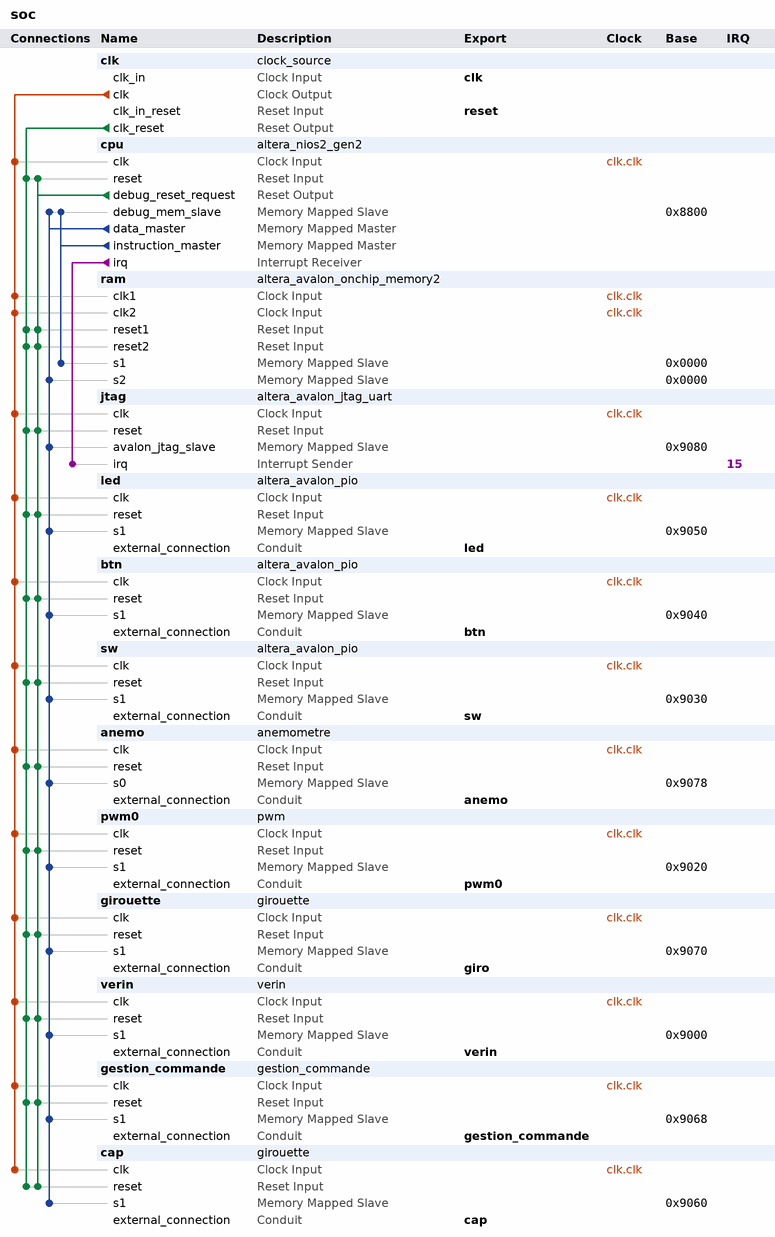
[diagram p0: system contents]
# Platform Designer (Qsys) system soc, Cyclone IV E EP4CE22F17C6
# Parameters at their usual value, and those the tool derives, are not listed.
package require -exact qsys 18.1
create_system soc
set_project_property DEVICE_FAMILY {Cyclone IV E}
set_project_property DEVICE EP4CE22F17C6

add_instance clk clock_source 18.1
set_instance_parameter_value clk clockFrequency 50000000

add_instance cpu altera_nios2_gen2 18.1
set_instance_parameter_value cpu dcache_size 2048
set_instance_parameter_value cpu exceptionSlave ram.s1
set_instance_parameter_value cpu icache_size 4096
set_instance_parameter_value cpu impl Tiny
set_instance_parameter_value cpu resetSlave ram.s1

add_instance ram altera_avalon_onchip_memory2 18.1
set_instance_parameter_value ram dataWidth 32
set_instance_parameter_value ram dualPort true
set_instance_parameter_value ram initMemContent true
set_instance_parameter_value ram initializationFileName onchip_mem.hex
set_instance_parameter_value ram memorySize 32768

add_instance jtag altera_avalon_jtag_uart 18.1
set_instance_parameter_value jtag simInteractiveOptions NO_INTERACTIVE_WINDOWS

add_instance led altera_avalon_pio 18.1
set_instance_parameter_value led direction Output
set_instance_parameter_value led width 8

add_instance btn altera_avalon_pio 18.1
set_instance_parameter_value btn direction Input
set_instance_parameter_value btn width 1

add_instance sw altera_avalon_pio 18.1
set_instance_parameter_value sw direction Input
set_instance_parameter_value sw width 4

add_instance anemo anemometre 1.0
set_instance_parameter_value anemo G_FREQ_IN 50000000

add_instance pwm0 pwm 1.0
set_instance_parameter_value pwm0 G_PWM_RESOLUTION 32

add_instance girouette girouette 1.0
set_instance_parameter_value girouette G_FREQ_IN 50000000

add_instance verin verin 1.0
set_instance_parameter_value verin G_FREQ_ADC 1000000
set_instance_parameter_value verin G_FREQ_IN 50000000

add_instance gestion_commande gestion_commande 1.0
set_instance_parameter_value gestion_commande G_FREQ_IN 50000000

add_instance cap girouette 1.0
set_instance_parameter_value cap G_FREQ_IN 50000000

# connections
add_connection clk.clk anemo.clk clock
add_connection clk.clk btn.clk clock
add_connection clk.clk cap.clk clock
add_connection clk.clk cpu.clk clock
add_connection clk.clk gestion_commande.clk clock
add_connection clk.clk girouette.clk clock
add_connection clk.clk jtag.clk clock
add_connection clk.clk led.clk clock
add_connection clk.clk pwm0.clk clock
add_connection clk.clk ram.clk1 clock
add_connection clk.clk ram.clk2 clock
add_connection clk.clk sw.clk clock
add_connection clk.clk verin.clk clock
add_connection clk.clk_reset anemo.reset reset
add_connection clk.clk_reset btn.reset reset
add_connection clk.clk_reset cap.reset reset
add_connection clk.clk_reset cpu.reset reset
add_connection clk.clk_reset gestion_commande.reset reset
add_connection clk.clk_reset girouette.reset reset
add_connection clk.clk_reset jtag.reset reset
add_connection clk.clk_reset led.reset reset
add_connection clk.clk_reset pwm0.reset reset
add_connection clk.clk_reset ram.reset1 reset
add_connection clk.clk_reset ram.reset2 reset
add_connection clk.clk_reset sw.reset reset
add_connection clk.clk_reset verin.reset reset
add_connection cpu.debug_reset_request anemo.reset reset
add_connection cpu.debug_reset_request btn.reset reset
add_connection cpu.debug_reset_request cap.reset reset
add_connection cpu.debug_reset_request cpu.reset reset
add_connection cpu.debug_reset_request gestion_commande.reset reset
add_connection cpu.debug_reset_request girouette.reset reset
add_connection cpu.debug_reset_request jtag.reset reset
add_connection cpu.debug_reset_request led.reset reset
add_connection cpu.debug_reset_request pwm0.reset reset
add_connection cpu.debug_reset_request ram.reset1 reset
add_connection cpu.debug_reset_request ram.reset2 reset
add_connection cpu.debug_reset_request sw.reset reset
add_connection cpu.debug_reset_request verin.reset reset
add_connection cpu.data_master anemo.s0 avalon
set_connection_parameter_value cpu.data_master/anemo.s0 baseAddress 0x9078
add_connection cpu.data_master btn.s1 avalon
set_connection_parameter_value cpu.data_master/btn.s1 baseAddress 0x9040
add_connection cpu.data_master cap.s1 avalon
set_connection_parameter_value cpu.data_master/cap.s1 baseAddress 0x9060
add_connection cpu.data_master cpu.debug_mem_slave avalon
set_connection_parameter_value cpu.data_master/cpu.debug_mem_slave baseAddress 0x8800
add_connection cpu.data_master gestion_commande.s1 avalon
set_connection_parameter_value cpu.data_master/gestion_commande.s1 baseAddress 0x9068
add_connection cpu.data_master girouette.s1 avalon
set_connection_parameter_value cpu.data_master/girouette.s1 baseAddress 0x9070
add_connection cpu.data_master jtag.avalon_jtag_slave avalon
set_connection_parameter_value cpu.data_master/jtag.avalon_jtag_slave baseAddress 0x9080
add_connection cpu.data_master led.s1 avalon
set_connection_parameter_value cpu.data_master/led.s1 baseAddress 0x9050
add_connection cpu.data_master pwm0.s1 avalon
set_connection_parameter_value cpu.data_master/pwm0.s1 baseAddress 0x9020
add_connection cpu.data_master ram.s2 avalon
set_connection_parameter_value cpu.data_master/ram.s2 baseAddress 0x0000
add_connection cpu.data_master sw.s1 avalon
set_connection_parameter_value cpu.data_master/sw.s1 baseAddress 0x9030
add_connection cpu.data_master verin.s1 avalon
set_connection_parameter_value cpu.data_master/verin.s1 baseAddress 0x9000
add_connection cpu.instruction_master cpu.debug_mem_slave avalon
set_connection_parameter_value cpu.instruction_master/cpu.debug_mem_slave baseAddress 0x8800
add_connection cpu.instruction_master ram.s1 avalon
set_connection_parameter_value cpu.instruction_master/ram.s1 baseAddress 0x0000
add_connection cpu.irq jtag.irq interrupt
set_connection_parameter_value cpu.irq/jtag.irq irqNumber 15

# exported interfaces
add_interface anemo conduit end
set_interface_property anemo EXPORT_OF anemo.external_connection
add_interface btn conduit end
set_interface_property btn EXPORT_OF btn.external_connection
add_interface cap conduit end
set_interface_property cap EXPORT_OF cap.external_connection
add_interface clk clock sink
set_interface_property clk EXPORT_OF clk.clk_in
add_interface gestion_commande conduit end
set_interface_property gestion_commande EXPORT_OF gestion_commande.external_connection
add_interface giro conduit end
set_interface_property giro EXPORT_OF girouette.external_connection
add_interface led conduit end
set_interface_property led EXPORT_OF led.external_connection
add_interface pwm0 conduit end
set_interface_property pwm0 EXPORT_OF pwm0.external_connection
add_interface reset reset sink
set_interface_property reset EXPORT_OF clk.clk_in_reset
add_interface sw conduit end
set_interface_property sw EXPORT_OF sw.external_connection
add_interface verin conduit end
set_interface_property verin EXPORT_OF verin.external_connection

set_interconnect_requirement {$system} qsys_mm.clockCrossingAdapter HANDSHAKE
set_interconnect_requirement {$system} qsys_mm.enableEccProtection FALSE
set_interconnect_requirement {$system} qsys_mm.insertDefaultSlave FALSE
set_interconnect_requirement {$system} qsys_mm.maxAdditionalLatency 1

save_system soc.qsys
